# Altium schematic sheet RF.SchDoc
size A2
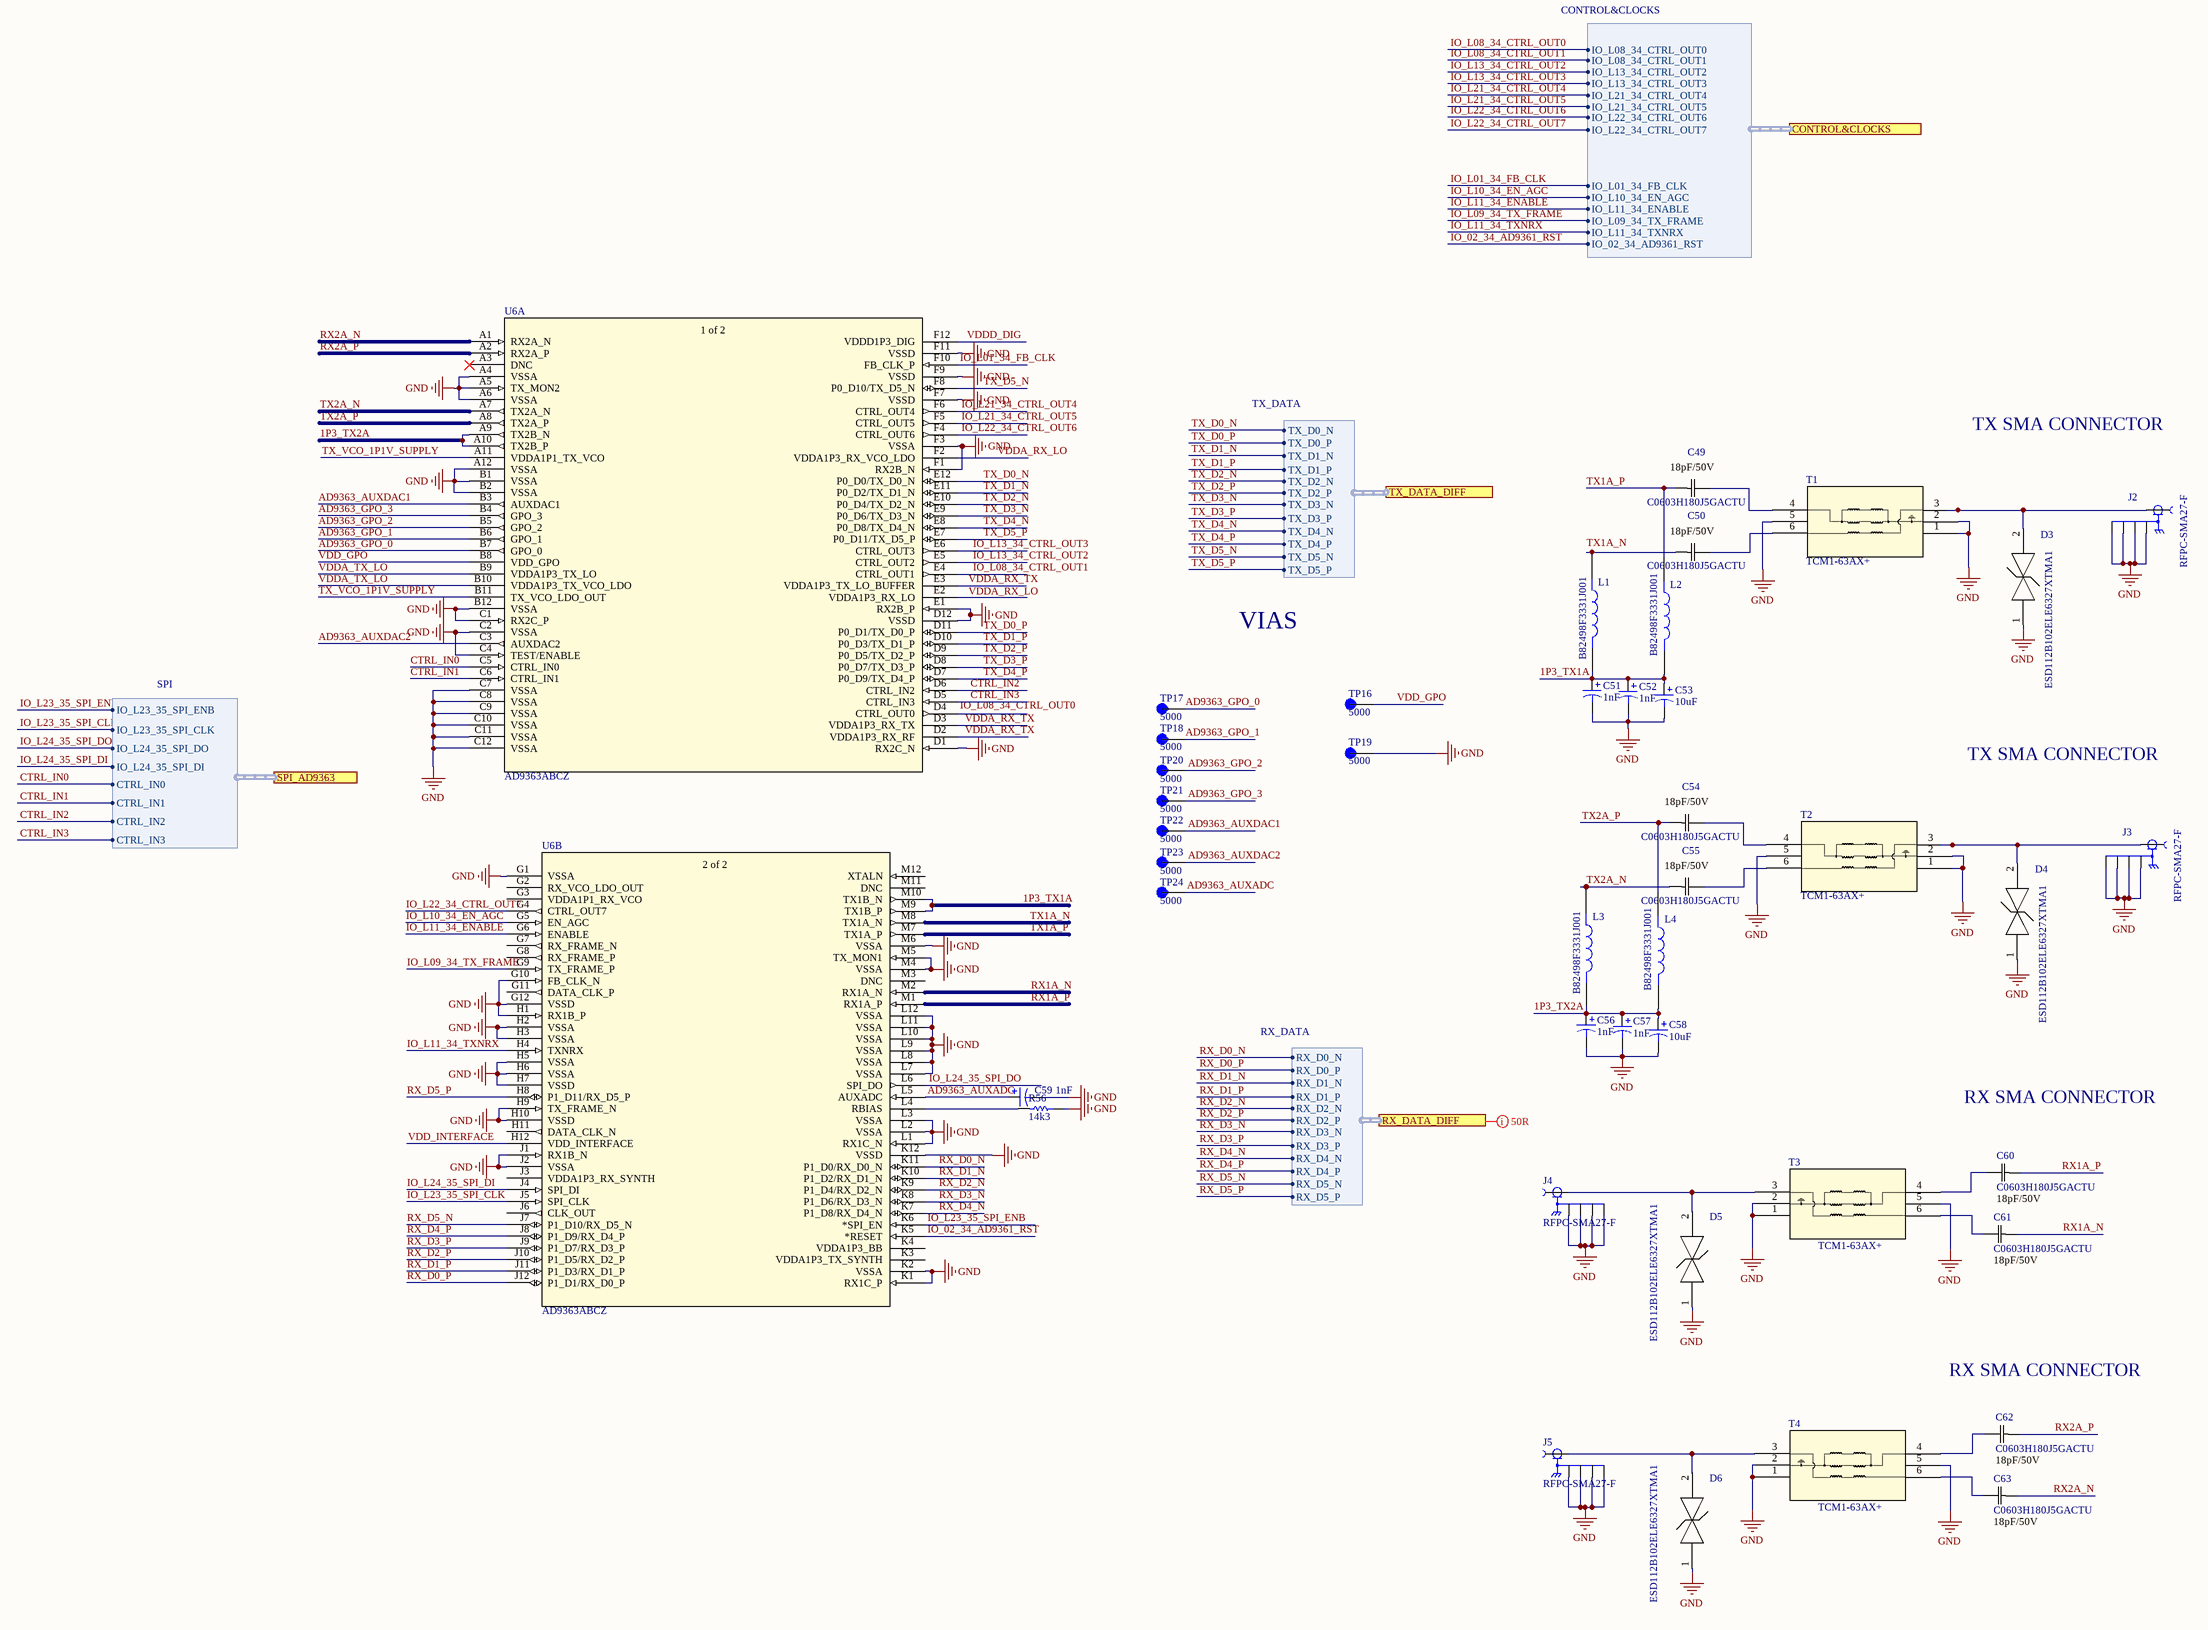
[diagram p0: RF.SchDoc]

## Parts
C49  C0603H180J5GACTU  RefDes: 18pF/50V  [CAPC17595_87N_KEM]
C50  C0603H180J5GACTU  RefDes: 18pF/50V  [CAPC17595_87N_KEM]
C51  value 1nF  [C0805]  (hidden comment: Cap Pol3)
C52  value 1nF  [C0805]  (hidden comment: Cap Pol3)
C53  value 10uF  [C0805]  (hidden comment: Cap Pol3)
C54  C0603H180J5GACTU  RefDes: 18pF/50V  [CAPC17595_87N_KEM]
C55  C0603H180J5GACTU  RefDes: 18pF/50V  [CAPC17595_87N_KEM]
C56  value 1nF  [C0805]  (hidden comment: Cap Pol3)
C57  value 1nF  [C0805]  (hidden comment: Cap Pol3)
C58  value 10uF  [C0805]  (hidden comment: Cap Pol3)
C59  value 1nF  [C0805]  (hidden comment: Cap Pol3)
C60  C0603H180J5GACTU  RefDes: 18pF/50V  [CAPC17595_87N_KEM]
C61  C0603H180J5GACTU  RefDes: 18pF/50V  [CAPC17595_87N_KEM]
C62  C0603H180J5GACTU  RefDes: 18pF/50V  [CAPC17595_87N_KEM]
C63  C0603H180J5GACTU  RefDes: 18pF/50V  [CAPC17595_87N_KEM]
D3  ESD112B102ELE6327XTMA1  [DIODFN100X60X43-2N]
D4  ESD112B102ELE6327XTMA1  [DIODFN100X60X43-2N]
D5  ESD112B102ELE6327XTMA1  [DIODFN100X60X43-2N]
D6  ESD112B102ELE6327XTMA1  [DIODFN100X60X43-2N]
J2  RFPC-SMA27-F  [GRADCONN_RFPC-SMA27-F]
J3  RFPC-SMA27-F  [GRADCONN_RFPC-SMA27-F]
J4  RFPC-SMA27-F  [GRADCONN_RFPC-SMA27-F]
J5  RFPC-SMA27-F  [GRADCONN_RFPC-SMA27-F]
L1  B82498F3331J001  [IND_B82498F3331J001]
L2  B82498F3331J001  [IND_B82498F3331J001]
L3  B82498F3331J001  [IND_B82498F3331J001]
L4  B82498F3331J001  [IND_B82498F3331J001]
R56  value 14k3  [0603]  (hidden comment: Res1)
T1  TCM1-63AX+  [DB1627_MNC]
T2  TCM1-63AX+  [DB1627_MNC]
T3  TCM1-63AX+  [DB1627_MNC]
T4  TCM1-63AX+  [DB1627_MNC]
TP16  5000  [KEYSTONE_5000]
TP17  5000  [KEYSTONE_5000]
TP18  5000  [KEYSTONE_5000]
TP19  5000  [KEYSTONE_5000]
TP20  5000  [KEYSTONE_5000]
TP21  5000  [KEYSTONE_5000]
TP22  5000  [KEYSTONE_5000]
TP23  5000  [KEYSTONE_5000]
TP24  5000  [KEYSTONE_5000]
U6  AD9363ABCZ  [BC-144-7_ADI]  (parts A,B of 2)

## Ports
CONTROL&CLOCKS (harness CONTROL&CLOCKS), RX_DATA_DIFF (harness RX_DATA), SPI_AD9363 (harness SPI), TX_DATA_DIFF (harness TX_DATA)

## Harnesses
RX_DATA: RX_D0_P, RX_D0_N, RX_D1_N, RX_D1_P, RX_D2_P, RX_D2_N, RX_D3_N, RX_D3_P, RX_D4_P, RX_D5_N, RX_D5_P, RX_D4_N
SPI: IO_L24_35_SPI_DO, IO_L24_35_SPI_DI, IO_L23_35_SPI_CLK, IO_L23_35_SPI_ENB, CTRL_IN0, CTRL_IN1, CTRL_IN2, CTRL_IN3
CONTROL&CLOCKS: IO_L08_34_CTRL_OUT1, IO_L13_34_CTRL_OUT2, IO_L13_34_CTRL_OUT3, IO_L21_34_CTRL_OUT4, IO_L21_34_CTRL_OUT5, IO_L22_34_CTRL_OUT6, IO_L22_34_CTRL_OUT7, IO_L01_34_FB_CLK, IO_L10_34_EN_AGC, IO_L11_34_ENABLE, IO_L09_34_TX_FRAME, IO_L11_34_TXNRX, IO_02_34_AD9361_RST, IO_L08_34_CTRL_OUT0
TX_DATA: TX_D0_P, TX_D0_N, TX_D1_N, TX_D1_P, TX_D2_P, TX_D2_N, TX_D3_N, TX_D3_P, TX_D4_P, TX_D4_N, TX_D5_N, TX_D5_P

## Nets
GND: C51.2 C52.2 C53.2 C56.2 C57.2 C58.2 C59.2 J2.G1 J2.G2 J2.G3 J2.G4 J3.G1 J3.G2 J3.G3 J3.G4 J4.G1 J4.G2 J4.G3 J4.G4 J5.G1 J5.G2 J5.G3 J5.G4 R56.1 T1.1 T1.2 T1.5 T2.1 T2.2 T2.5 T3.1 T3.2 T3.5 T4.1 T4.2 T4.5 TP19.TP U6.A4(VSSA) U6.A5(TX_MON2) U6.A6(VSSA) U6.A12(VSSA) U6.B1(VSSA) U6.B2(VSSA) U6.B12(VSSA) U6.C1(RX2C_P) U6.C2(VSSA) U6.C4(TEST/ENABLE) U6.C7(VSSA) U6.C8(VSSA) U6.C9(VSSA) U6.C10(VSSA) U6.C11(VSSA) U6.C12(VSSA) U6.D1(RX2C_N) U6.D12(VSSD) U6.E1(RX2B_P) U6.F1(RX2B_N) U6.F3(VSSA) U6.F7(VSSD) U6.F9(VSSD) U6.F11(VSSD) U6.G1(VSSA) U6.G10(FB_CLK_N) U6.G12(VSSD) U6.H1(RX1B_P) U6.H2(VSSA) U6.H3(VSSA) U6.H5(VSSA) U6.H6(VSSA) U6.H7(VSSD) U6.H9(TX_FRAME_N) U6.H10(VSSD) U6.J1(RX1B_N) U6.J2(VSSA) U6.K1(RX1C_P) U6.K2(VSSA) U6.K12(VSSD) U6.L1(RX1C_N) U6.L2(VSSA) U6.L3(VSSA) U6.L7(VSSA) U6.L8(VSSA) U6.L9(VSSA) U6.L10(VSSA) U6.L11(VSSA) U6.L12(VSSA) U6.M4(VSSA) U6.M5(TX_MON1) U6.M6(VSSA)
1P3_TX1A: C51.1 C52.1 C53.1 L1.1 L2.1 U6.M9(TX1B_P) U6.M10(TX1B_N)
1P3_TX2A: C56.1 C57.1 C58.1 L3.1 L4.1 U6.A9(TX2B_N) U6.A10(TX2B_P)
AD9363_AUXADC: C59.1 TP24.TP U6.L5(AUXADC)
AD9363_AUXDAC1: TP22.TP U6.B3(AUXDAC1)
AD9363_AUXDAC2: TP23.TP U6.C3(AUXDAC2)
AD9363_GPO_0: TP17.TP U6.B7(GPO_0)
AD9363_GPO_1: TP18.TP U6.B6(GPO_1)
AD9363_GPO_2: TP20.TP U6.B5(GPO_2)
AD9363_GPO_3: TP21.TP U6.B4(GPO_3)
CTRL_IN0: U6.C5(CTRL_IN0) ; port SPI_AD9363.CTRL_IN0
CTRL_IN1: U6.C6(CTRL_IN1) ; port SPI_AD9363.CTRL_IN1
CTRL_IN2: U6.D6(CTRL_IN2) ; port SPI_AD9363.CTRL_IN2
CTRL_IN3: U6.D5(CTRL_IN3) ; port SPI_AD9363.CTRL_IN3
IO_02_34_AD9361_RST: U6.K5(*RESET) ; port CONTROL&CLOCKS.IO_02_34_AD9361_RST
IO_L01_34_FB_CLK: U6.F10(FB_CLK_P) ; port CONTROL&CLOCKS.IO_L01_34_FB_CLK
IO_L08_34_CTRL_OUT0: port CONTROL&CLOCKS.IO_L08_34_CTRL_OUT0
IO_L08_34_CTRL_OUT1: U6.E4(CTRL_OUT1) ; port CONTROL&CLOCKS.IO_L08_34_CTRL_OUT1
IO_L09_34_TX_FRAME: U6.G9(TX_FRAME_P) ; port CONTROL&CLOCKS.IO_L09_34_TX_FRAME
IO_L10_34_EN_AGC: U6.G5(EN_AGC) ; port CONTROL&CLOCKS.IO_L10_34_EN_AGC
IO_L11_34_ENABLE: U6.G6(ENABLE) ; port CONTROL&CLOCKS.IO_L11_34_ENABLE
IO_L11_34_TXNRX: U6.H4(TXNRX) ; port CONTROL&CLOCKS.IO_L11_34_TXNRX
IO_L13_34_CTRL_OUT2: U6.E5(CTRL_OUT2) ; port CONTROL&CLOCKS.IO_L13_34_CTRL_OUT2
IO_L13_34_CTRL_OUT3: U6.E6(CTRL_OUT3) ; port CONTROL&CLOCKS.IO_L13_34_CTRL_OUT3
IO_L21_34_CTRL_OUT4: U6.F6(CTRL_OUT4) ; port CONTROL&CLOCKS.IO_L21_34_CTRL_OUT4
IO_L21_34_CTRL_OUT5: U6.F5(CTRL_OUT5) ; port CONTROL&CLOCKS.IO_L21_34_CTRL_OUT5
IO_L22_34_CTRL_OUT6: U6.F4(CTRL_OUT6) ; port CONTROL&CLOCKS.IO_L22_34_CTRL_OUT6
IO_L22_34_CTRL_OUT7: U6.G4(CTRL_OUT7) ; port CONTROL&CLOCKS.IO_L22_34_CTRL_OUT7
IO_L23_35_SPI_CLK: U6.J5(SPI_CLK) ; port SPI_AD9363.IO_L23_35_SPI_CLK
IO_L23_35_SPI_ENB: U6.K6(*SPI_EN) ; port SPI_AD9363.IO_L23_35_SPI_ENB
IO_L24_35_SPI_DI: U6.J4(SPI_DI) ; port SPI_AD9363.IO_L24_35_SPI_DI
IO_L24_35_SPI_DO: U6.L6(SPI_DO) ; port SPI_AD9363.IO_L24_35_SPI_DO
RX1A_N: C61.1 U6.M2(RX1A_N)
RX1A_P: C60.1 U6.M1(RX1A_P)
RX2A_N: C63.1 U6.A1(RX2A_N)
RX2A_P: C62.1 U6.A2(RX2A_P)
RX_D0_N: U6.K11(P1_D0/RX_D0_N) ; port RX_DATA_DIFF.RX_D0_N
RX_D0_P: U6.J12(P1_D1/RX_D0_P) ; port RX_DATA_DIFF.RX_D0_P
RX_D1_N: U6.K10(P1_D2/RX_D1_N) ; port RX_DATA_DIFF.RX_D1_N
RX_D1_P: U6.J11(P1_D3/RX_D1_P) ; port RX_DATA_DIFF.RX_D1_P
RX_D2_N: U6.K9(P1_D4/RX_D2_N) ; port RX_DATA_DIFF.RX_D2_N
RX_D2_P: U6.J10(P1_D5/RX_D2_P) ; port RX_DATA_DIFF.RX_D2_P
RX_D3_N: U6.K8(P1_D6/RX_D3_N) ; port RX_DATA_DIFF.RX_D3_N
RX_D3_P: U6.J9(P1_D7/RX_D3_P) ; port RX_DATA_DIFF.RX_D3_P
RX_D4_N: U6.K7(P1_D8/RX_D4_N) ; port RX_DATA_DIFF.RX_D4_N
RX_D4_P: U6.J8(P1_D9/RX_D4_P) ; port RX_DATA_DIFF.RX_D4_P
RX_D5_N: U6.J7(P1_D10/RX_D5_N) ; port RX_DATA_DIFF.RX_D5_N
RX_D5_P: U6.H8(P1_D11/RX_D5_P) ; port RX_DATA_DIFF.RX_D5_P
TX1A_N: U6.M8(TX1A_N)
TX1A_P: C49.1 L2.2 U6.M7(TX1A_P)
TX2A_N: C55.1 L3.2 U6.A7(TX2A_N)
TX2A_P: C54.1 L4.2 U6.A8(TX2A_P)
TX_D0_N: U6.E12(P0_D0/TX_D0_N) ; port TX_DATA_DIFF.TX_D0_N
TX_D0_P: U6.D11(P0_D1/TX_D0_P) ; port TX_DATA_DIFF.TX_D0_P
TX_D1_N: U6.E11(P0_D2/TX_D1_N) ; port TX_DATA_DIFF.TX_D1_N
TX_D1_P: U6.D10(P0_D3/TX_D1_P) ; port TX_DATA_DIFF.TX_D1_P
TX_D2_N: U6.E10(P0_D4/TX_D2_N) ; port TX_DATA_DIFF.TX_D2_N
TX_D2_P: U6.D9(P0_D5/TX_D2_P) ; port TX_DATA_DIFF.TX_D2_P
TX_D3_N: U6.E9(P0_D6/TX_D3_N) ; port TX_DATA_DIFF.TX_D3_N
TX_D3_P: U6.D8(P0_D7/TX_D3_P) ; port TX_DATA_DIFF.TX_D3_P
TX_D4_N: U6.E8(P0_D8/TX_D4_N) ; port TX_DATA_DIFF.TX_D4_N
TX_D4_P: U6.D7(P0_D9/TX_D4_P) ; port TX_DATA_DIFF.TX_D4_P
TX_D5_N: U6.F8(P0_D10/TX_D5_N) ; port TX_DATA_DIFF.TX_D5_N
TX_D5_P: U6.E7(P0_D11/TX_D5_P) ; port TX_DATA_DIFF.TX_D5_P
TX_VCO_1P1V_SUPPLY: U6.A11(VDDA1P1_TX_VCO) U6.B11(TX_VCO_LDO_OUT)
VDD_GPO: TP16.TP U6.B8(VDD_GPO)
VDD_INTERFACE: U6.H12(VDD_INTERFACE)
VDDA_RX_LO: U6.F2(VDDA1P3_RX_VCO_LDO)
VDDA_RX_TX: U6.D2(VDDA1P3_RX_RF) U6.D3(VDDA1P3_RX_TX) U6.E3(VDDA1P3_TX_LO_BUFFER)
VDDA_TX_LO: U6.B9(VDDA1P3_TX_LO) U6.B10(VDDA1P3_TX_VCO_LDO)
VDDD_DIG: U6.F12(VDDD1P3_DIG)
NetC49_2: C49.2 T1.4
NetC50_1: C50.1 L1.2
NetC50_2: C50.2 T1.6
NetC54_2: C54.2 T2.4
NetC55_2: C55.2 T2.6
NetC60_2: C60.2 T3.4
NetC61_2: C61.2 T3.6
NetC62_2: C62.2 T4.4
NetC63_2: C63.2 T4.6
NetJ2_1: J2.1 T1.3
NetJ3_1: J3.1 T2.3
NetJ4_1: J4.1 T3.3
NetJ5_1: J5.1 T4.3
NetR56_2: R56.2 U6.L4(RBIAS)

Not connected (* = marked no-connect by the designer): D3 1 2; D4 1 2; D5 1 2; D6 1 2; U6 A3(DNC)* D4(CTRL_OUT0) E2(VDDA1P3_RX_LO) G2(RX_VCO_LDO_OUT) G3(VDDA1P1_RX_VCO) G7(RX_FRAME_N) G8(RX_FRAME_P) G11(DATA_CLK_P) H11(DATA_CLK_N) J3(VDDA1P3_RX_SYNTH) J6(CLK_OUT) K3(VDDA1P3_TX_SYNTH) K4(VDDA1P3_BB) M3(DNC) M11(DNC) M12(XTALN)

## Layout directives
mark named 50R: (no net found under the mark)

## Notes on the sheet
- TX SMA CONNECTOR
- VIAS
- RX SMA CONNECTOR
- Labels drawn without touching a wire or pin: IO_L08_34_CTRL_OUT0, TX1A_N, VDDA_RX_LO
- (in symbol AD9363ABCZ, part A) 1 of 2
- (in symbol AD9363ABCZ, part B) 2 of 2

## Library data of the parts
C49 C50 C54 C55 C60-C63 = C0603H180J5GACTU: No Description Available; Mfr_Name: Kemet
C51-C53 C56-C59 = Cap Pol3: Polarized Capacitor (Surface Mount); Published: 8-Jun-2000; LatestRevisionDate: 29-May-2009; LatestRevisionNote: IPC-7351 Footprint Added.; PackageReference: C0805; Publisher: Altium Limited; PackageDescription: Chip Capacitor
D3-D6 = ESD112B102ELE6327XTMA1: TVS RF PLUTO
J2-J5 = RFPC-SMA27-F: MF: {'manufacturer': u'GCT (Gradconn)'}; Package: None; Price: None; Value: *; MP: RFPC-SMA27-F; Availability: Unavailable
L1-L4 = B82498F3331J001: MF: TDK; SnapEDA_Link: https://www.snapeda.com/parts/B82498F3331J001/TDK/view-part/?ref=snap; Availability: In Stock; Value: *; Check_prices: https://www.snapeda.com/parts/B82498F3331J001/TDK/view-part/?ref=eda; Purchase-URL: https://pricing.snapeda.com/search/part/B82498F3331J001/?ref=eda; Package: None; Price: None; MP: B82498F3331J001
R56 = Res1_1: Resistor; Manufacturer: Generic Components; Class I: Passive; Published: 8-Jun-2000; Revision: July-2002: Re-released for DXP Platform.; Publisher: Altium Limited; Class II: Resistor; REF FARNELL 1206 SMD 510R: 4387065; REF FARNELL 1206 SMD 1K: 912475; REF FARNELL 1206 SMD 10K: 912591; REF FARNELL 0603 SMD: 612-595
T1-T4 = TCM1-63AX+: No Description Available; Mfr_Name: Mini Circuits; RefDes: RefDes; Type: Type
TP16-TP24 = 5000: Test Point Miniature THM H .300 Nylon 46 Insulated Red PhosBronze/Silver | Keystone Electronics 5000; SnapEDA_Link: https://www.snapeda.com/parts/5000/Keystone/view-part/?ref=snap; Package: Test Point Keystone Electronics; Value: *; MF: Keystone Electronics; MP: 5000; Check_prices: https://www.snapeda.com/parts/5000/Keystone/view-part/?ref=eda
U6 = AD9363ABCZ: No Description Available; Mfr_Name: Analog Devices Inc; Type: RF; RefDes: RefDes